# EAGLE schematic squematics (EAGLE 7.4.0)
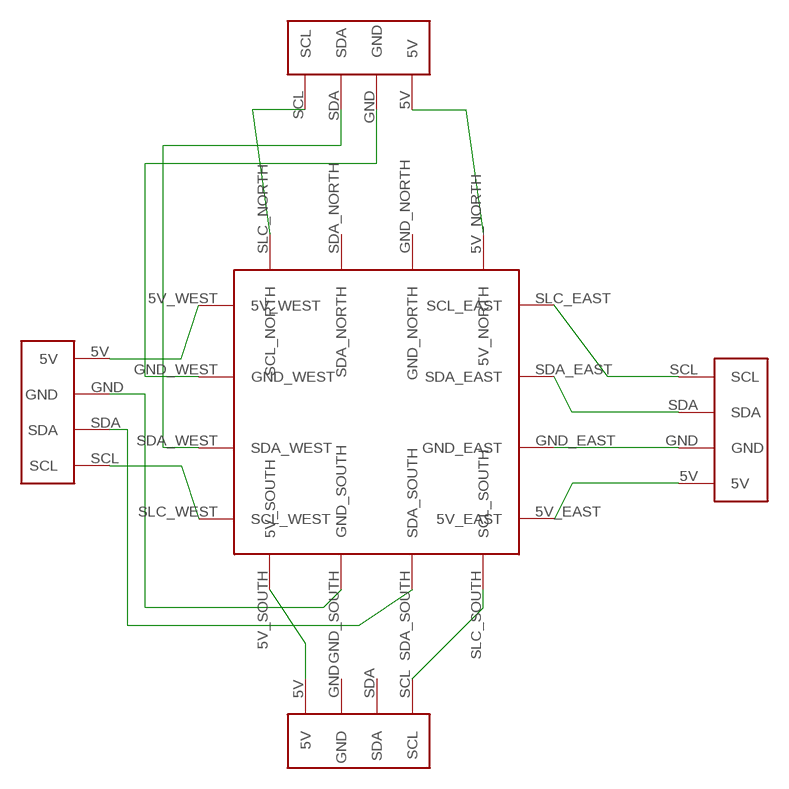
[diagram p0: schematic, sheet 1]

## Parts
EAST  FOUR_SIDE_PINS  [FOUR_SIDE_PINS]
NORTH  FOUR_SIDE_PINS  [FOUR_SIDE_PINS]
U$1  CONNECTORS_PIN_DEVICE  [CONNECTORS_PIN]
U$2  FOUR_SIDE_PINS  [FOUR_SIDE_PINS]
U$3  FOUR_SIDE_PINS  [FOUR_SIDE_PINS]

## Nets
N$1: NORTH.SCL U$1.SLC_NORTH(SCL_NORTH)
N$2: NORTH.SDA U$1.SDA_WEST
N$3: NORTH.GND U$1.GND_WEST
N$4: NORTH.5V U$1.5V_NORTH
N$5: EAST.SCL U$1.SLC_EAST(SCL_EAST)
N$6: EAST.SDA U$1.SDA_EAST
N$7: EAST.GND U$1.GND_EAST
N$8: EAST.5V U$1.5V_EAST
N$9: U$1.5V_WEST U$2.5V
N$10: U$1.SLC_WEST(SCL_WEST) U$2.SCL
N$11: U$1.SDA_SOUTH U$2.SDA
N$12: U$1.GND_SOUTH U$2.GND
N$13: U$1.5V_SOUTH U$3.5V
N$14: U$1.SLC_SOUTH(SCL_SOUTH) U$3.SCL
Unconnected: U$1.GND_NORTH U$1.SDA_NORTH U$3.GND U$3.SDA

## Library data of the parts
EAST NORTH U$2 U$3 = probatio_fourSidePins:FOUR_SIDE_PINS
U$1 = probatioBaseConnector:CONNECTORS_PIN_DEVICE